# Altium schematic sheet 主控.SchDoc
size A4
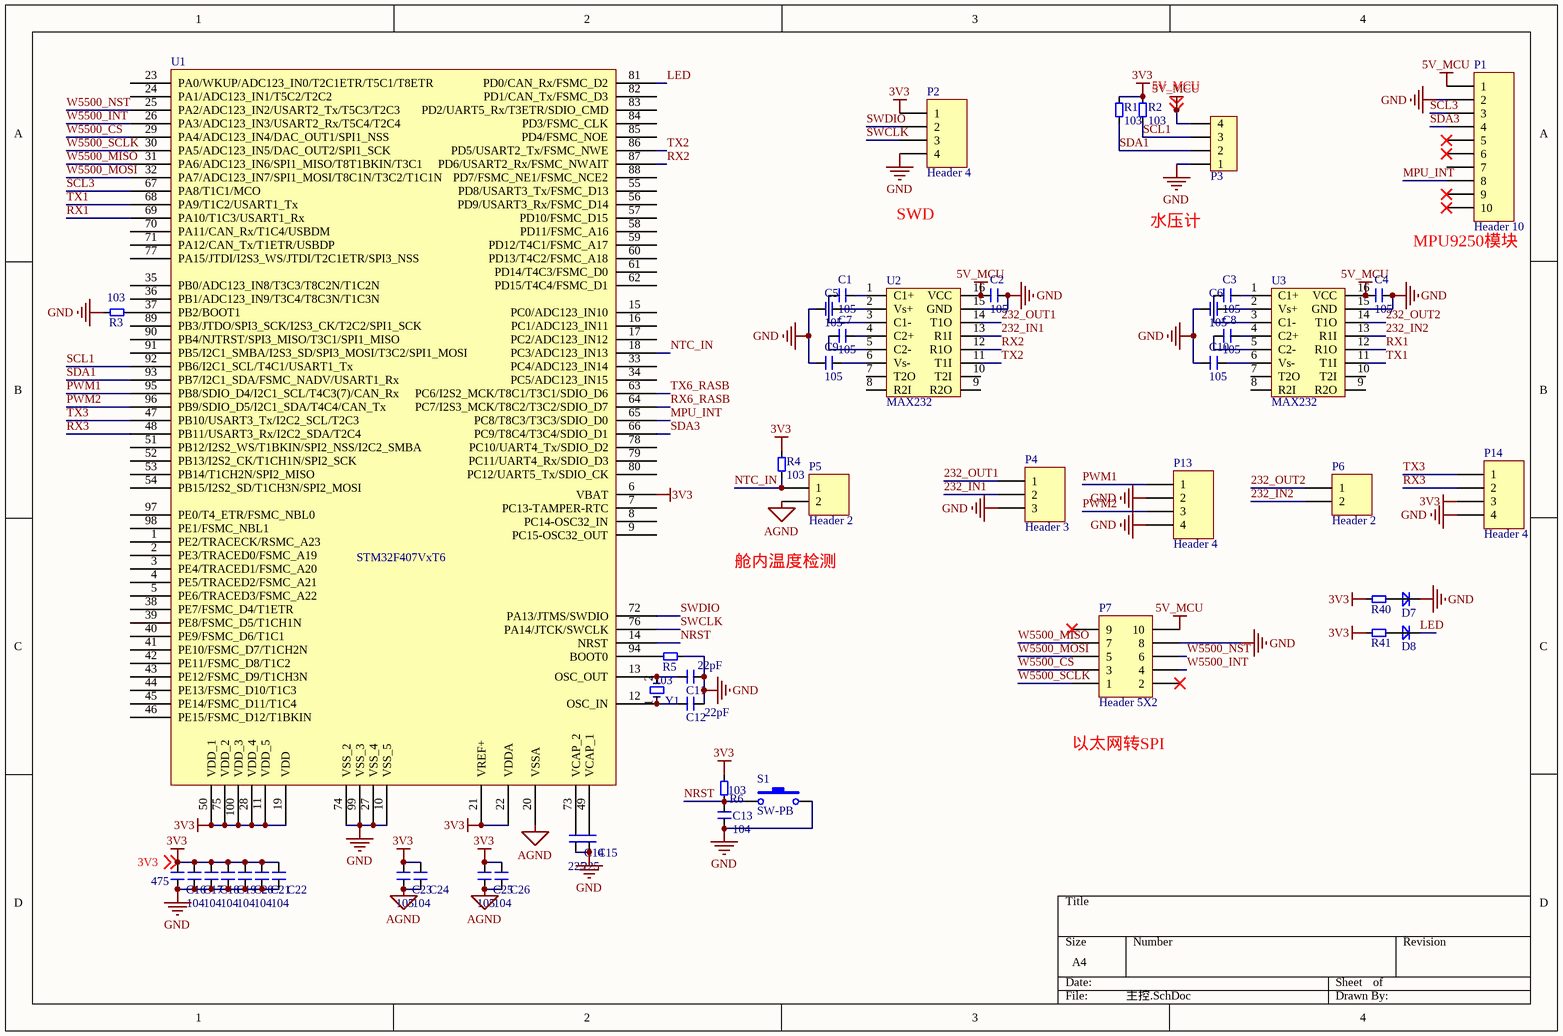
[diagram p0: 主控.SchDoc]

## Parts
C1  Parameter 1: 105  [0603C]  (hidden comment: 0603C)
C2  Parameter 1: 105  [0603C]  (hidden comment: 0603C)
C3  Parameter 1: 105  [0603C]  (hidden comment: 0603C)
C4  Parameter 1: 105  [0603C]  (hidden comment: 0603C)
C5  Parameter 1: 105  [0603C]  (hidden comment: 0603C)
C6  Parameter 1: 105  [0603C]  (hidden comment: 0603C)
C7  Parameter 1: 105  [0603C]  (hidden comment: 0603C)
C8  Parameter 1: 105  [0603C]  (hidden comment: 0603C)
C9  Parameter 1: 105  [0603C]  (hidden comment: 0603C)
C10  Parameter 1: 105  [0603C]  (hidden comment: 0603C)
C11  Parameter 1: 22pF  [0603C]  (hidden comment: 0603C)
C12  Parameter 1: 22pF  [0603C]  (hidden comment: 0603C)
C13  Parameter 1: 104  [0603C]  (hidden comment: 0603C)
C14  Parameter 1: 225  [0603C]  (hidden comment: 0603C)
C15  Parameter 1: 225  [0603C]  (hidden comment: 0603C)
C16  Parameter 1: 475  [0603C]  (hidden comment: 0603C)
C17  Parameter 1: 104  [0603C]  (hidden comment: 0603C)
C18  Parameter 1: 104  [0603C]  (hidden comment: 0603C)
C19  Parameter 1: 104  [0603C]  (hidden comment: 0603C)
C20  Parameter 1: 104  [0603C]  (hidden comment: 0603C)
C21  Parameter 1: 104  [0603C]  (hidden comment: 0603C)
C22  Parameter 1: 104  [0603C]  (hidden comment: 0603C)
C23  Parameter 1: 105  [0603C]  (hidden comment: 0603C)
C24  Parameter 1: 104  [0603C]  (hidden comment: 0603C)
C25  Parameter 1: 105  [0603C]  (hidden comment: 0603C)
C26  Parameter 1: 104  [0603C]  (hidden comment: 0603C)
D7  0603D  [0603D]  (value not drawn)
D8  0603D  [0603D]  (value not drawn)
P1  Header 10  [HDR1X10]
P2  Header 4  [HDR1X4]
P3  1.27mm-4p  [1.27mm-4P]  (value not drawn)
P4  Header 3  [DB129-3]
P5  Header 2  [HDR1X2]
P6  Header 2  [DB129]
P7  Header 5X2  [HDR2X5]
P13  Header 4  [HDR1X4]
P14  Header 4  [HDR1X4]
R1  Parameter 1: 103  [0603R]  (hidden comment: 0603R)
R2  Parameter 1: 103  [0603R]  (hidden comment: 0603R)
R3  Parameter 1: 103  [0603R]  (hidden comment: 0603R)
R4  Parameter 1: 103  [0603R]  (hidden comment: 0603R)
R5  Parameter 1: 103  [0603R]  (hidden comment: 0603R)
R6  Parameter 1: 103  [0603R]  (hidden comment: 0603R)
R40  0603R  [0603R]  (value not drawn)
R41  0603R  [0603R]  (value not drawn)
S1  SW-PB  [按键 3x6]
U1  STM32F407VxT6  [LQFP-100_M]
U2  MAX232  [SOP16]
U3  MAX232  [SOP16]
Y1  XTAL_5032  [XTAL贴片]  (value not drawn)

## Nets
3V3: C16.2 C17.2 C18.2 C19.2 C20.2 C21.2 C22.2 C23.2 C24.2 C25.1 C26.1 P2.1 P14.3 R1.2 R2.2 R4.2 R6.2 R40.1 R41.1 U1.6(VBAT) U1.11(VDD_5) U1.19(VDD) U1.21(VREF+) U1.22(VDDA) U1.28(VDD_4) U1.50(VDD_1) U1.75(VDD_2) U1.100(VDD_3) ; off-sheet 3V3
5V_MCU: C2.1 C4.1 P1.1 P3.4 P7.10 U2.16(VCC) U3.16(VCC) ; off-sheet 5V_MCU
AGND: C23.1 C24.1 C25.2 C26.2 P5.2 U1.20(VSSA)
GND: C2.2 C4.2 C5.1 C6.1 C9.1 C10.1 C11.2 C12.2 C13.1 C14.1 C15.1 C16.1 C17.1 C18.1 C19.1 C20.1 C21.1 C22.1 D7.2 P1.2 P2.4 P3.1 P4.3 P7.8 P13.2 P13.4 P14.4 R3.1 R5.2 S1.2 U1.10(VSS_5) U1.27(VSS_4) U1.74(VSS_2) U1.99(VSS_3) U2.15(GND) U3.15(GND)
232_IN1: P4.2 U2.13(R1I)
232_IN2: P6.2 U3.13(R1I)
232_OUT1: P4.1 U2.14(T1O)
232_OUT2: P6.1 U3.14(T1O)
LED: D8.2 U1.81(PD0/CAN_Rx/FSMC_D2)
MPU_INT: P1.8 U1.65(PC8/T8C3/T3C3/SDIO_D0)
NRST: C13.2 R6.1 S1.1 U1.14(NRST)
NTC_IN: P5.1 R4.1 U1.18(PC3/ADC123_IN13)
PWM1: P13.1 U1.95(PB8/SDIO_D4/I2C1_SCL/T4C3(7)/CAN_Rx)
PWM2: P13.3 U1.96(PB9/SDIO_D5/I2C1_SDA/T4C4/CAN_Tx)
RX1: U1.69(PA10/T1C3/USART1_Rx) U3.12(R1O)
RX2: U1.87(PD6/USART2_Rx/FSMC_NWAIT) U2.12(R1O)
RX3: P14.2 U1.48(PB11/USART3_Rx/I2C2_SDA/T2C4)
RX6_RASB: U1.64(PC7/I2S3_MCK/T8C2/T3C2/SDIO_D7)
SCL1: P3.3 R2.1 U1.92(PB6/I2C1_SCL/T4C1/USART1_Tx)
SCL3: P1.3 U1.67(PA8/T1C1/MCO)
SDA1: P3.2 R1.1 U1.93(PB7/I2C1_SDA/FSMC_NADV/USART1_Rx)
SDA3: P1.4 U1.66(PC9/T8C4/T3C4/SDIO_D1)
SWCLK: P2.3 U1.76(PA14/JTCK/SWCLK)
SWDIO: P2.2 U1.72(PA13/JTMS/SWDIO)
TX1: U1.68(PA9/T1C2/USART1_Tx) U3.11(T1I)
TX2: U1.86(PD5/USART2_Tx/FSMC_NWE) U2.11(T1I)
TX3: P14.1 U1.47(PB10/USART3_Tx/I2C2_SCL/T2C3)
TX6_RASB: U1.63(PC6/I2S2_MCK/T8C1/T3C1/SDIO_D6)
W5500_CS: P7.3 U1.29(PA4/ADC123_IN4/DAC_OUT1/SPI1_NSS)
W5500_INT: P7.4 U1.26(PA3/ADC123_IN3/USART2_Rx/T5C4/T2C4)
W5500_MISO: P7.7 U1.31(PA6/ADC123_IN6/SPI1_MISO/T8T1BKIN/T3C1)
W5500_MOSI: P7.5 U1.32(PA7/ADC123_IN7/SPI1_MOSI/T8C1N/T3C2/T1C1N)
W5500_NST: P7.6 U1.25(PA2/ADC123_IN2/USART2_Tx/T5C3/T2C3)
W5500_SCLK: P7.1 U1.30(PA5/ADC123_IN5/DAC_OUT2/SPI1_SCK)
NetC1_1: C1.1 U2.3(C1-)
NetC1_2: C1.2 U2.1(C1+)
NetC3_1: C3.1 U3.3(C1-)
NetC3_2: C3.2 U3.1(C1+)
NetC5_2: C5.2 U2.2(Vs+)
NetC6_2: C6.2 U3.2(Vs+)
NetC7_1: C7.1 U2.5(C2-)
NetC7_2: C7.2 U2.4(C2+)
NetC8_1: C8.1 U3.5(C2-)
NetC8_2: C8.2 U3.4(C2+)
NetC9_2: C9.2 U2.6(Vs-)
NetC10_2: C10.2 U3.6(Vs-)
NetC11_1: C11.1 U1.13(OSC_OUT) Y1.2
NetC12_1: C12.1 U1.12(OSC_IN) Y1.1
NetC14_2: C14.2 U1.73(VCAP_2)
NetC15_2: C15.2 U1.49(VCAP_1)
NetD7_1: D7.1 R40.2
NetD8_1: D8.1 R41.2
NetR3_2: R3.2 U1.37(PB2/BOOT1)
NetR5_1: R5.1 U1.94(BOOT0)

Not connected (* = marked no-connect by the designer): P1 5* 6* 7 9* 10*; P7 2* 9*; U1 1(PE2/TRACECK/RSMC_A23) 2(PE3/TRACED0/FSMC_A19) 3(PE4/TRACED1/FSMC_A20) 4(PE5/TRACED2/FSMC_A21) 5(PE6/TRACED3/FSMC_A22) 7(PC13-TAMPER-RTC) 8(PC14-OSC32_IN) 9(PC15-OSC32_OUT) 15(PC0/ADC123_IN10) 16(PC1/ADC123_IN11) 17(PC2/ADC123_IN12) 23(PA0/WKUP/ADC123_IN0/T2C1ETR/T5C1/T8ETR) 24(PA1/ADC123_IN1/T5C2/T2C2) 33(PC4/ADC123_IN14) 34(PC5/ADC123_IN15) 35(PB0/ADC123_IN8/T3C3/T8C2N/T1C2N) 36(PB1/ADC123_IN9/T3C4/T8C3N/T1C3N) 38(PE7/FSMC_D4/T1ETR) 39(PE8/FSMC_D5/T1CH1N) 40(PE9/FSMC_D6/T1C1) 41(PE10/FSMC_D7/T1CH2N) 42(PE11/FSMC_D8/T1C2) 43(PE12/FSMC_D9/T1CH3N) 44(PE13/FSMC_D10/T1C3) 45(PE14/FSMC_D11/T1C4) 46(PE15/FSMC_D12/T1BKIN) 51(PB12/I2S2_WS/T1BKIN/SPI2_NSS/I2C2_SMBA) 52(PB13/I2S2_CK/T1CH1N/SPI2_SCK) 53(PB14/T1CH2N/SPI2_MISO) 54(PB15/I2S2_SD/T1CH3N/SPI2_MOSI) 55(PD8/USART3_Tx/FSMC_D13) 56(PD9/USART3_Rx/FSMC_D14) 57(PD10/FSMC_D15) 58(PD11/FSMC_A16) 59(PD12/T4C1/FSMC_A17) 60(PD13/T4C2/FSMC_A18) 61(PD14/T4C3/FSMC_D0) 62(PD15/T4C4/FSMC_D1) 70(PA11/CAN_Rx/T1C4/USBDM) 71(PA12/CAN_Tx/T1ETR/USBDP) 77(PA15/JTDI/I2S3_WS/JTDI/T2C1ETR/SPI3_NSS) 78(PC10/UART4_Tx/SDIO_D2) 79(PC11/UART4_Rx/SDIO_D3) 80(PC12/UART5_Tx/SDIO_CK) 82(PD1/CAN_Tx/FSMC_D3) 83(PD2/UART5_Rx/T3ETR/SDIO_CMD) 84(PD3/FSMC_CLK) 85(PD4/FSMC_NOE) 88(PD7/FSMC_NE1/FSMC_NCE2) 89(PB3/JTDO/SPI3_SCK/I2S3_CK/T2C2/SPI1_SCK) 90(PB4/NJTRST/SPI3_MISO/T3C1/SPI1_MISO) 91(PB5/I2C1_SMBA/I2S3_SD/SPI3_MOSI/T3C2/SPI1_MOSI) 97(PE0/T4_ETR/FSMC_NBL0) 98(PE1/FSMC_NBL1); U2 7(T2O) 8(R2I) 9(R2O) 10(T2I); U3 7(T2O) 8(R2I) 9(R2O) 10(T2I)

## Notes on the sheet
- SWD
- 水压计
- (near P1) MPU9250模块
- 舱内温度检测
- (near P7) 以太网转SPI

## Library data of the parts
P1 = Header 10: Header, 10-Pin; LatestRevisionDate: 17-Jul-2002; LatestRevisionNote: Re-released for DXP Platform.; Publisher: Altium Limited
P2 P13 P14 = Header 4: Header, 4-Pin; LatestRevisionDate: 17-Jul-2002; LatestRevisionNote: Re-released for DXP Platform.; Publisher: Altium Limited
P4 = Header 3: Header, 3-Pin; LatestRevisionDate: 17-Jul-2002; LatestRevisionNote: Re-released for DXP Platform.; Publisher: Altium Limited
P5 P6 = Header 2: Header, 2-Pin; LatestRevisionDate: 17-Jul-2002; LatestRevisionNote: Re-released for DXP Platform.; Publisher: Altium Limited
P7 = Header 5X2: Header, 5-Pin, Dual row; LatestRevisionDate: 17-Jul-2002; LatestRevisionNote: Re-released for DXP Platform.; Publisher: Altium Limited
S1 = SW-PB: Switch; Published: 24-Mar-1999; LatestRevisionDate: 17-Jul-2002; LatestRevisionNote: Re-released for DXP Platform.; PackageReference: SPST-2; Publisher: Altium Limited; PackageDescription: Switch; 2 Leads